# EAGLE design eeZeeAmp (EAGLE 7.1.0)
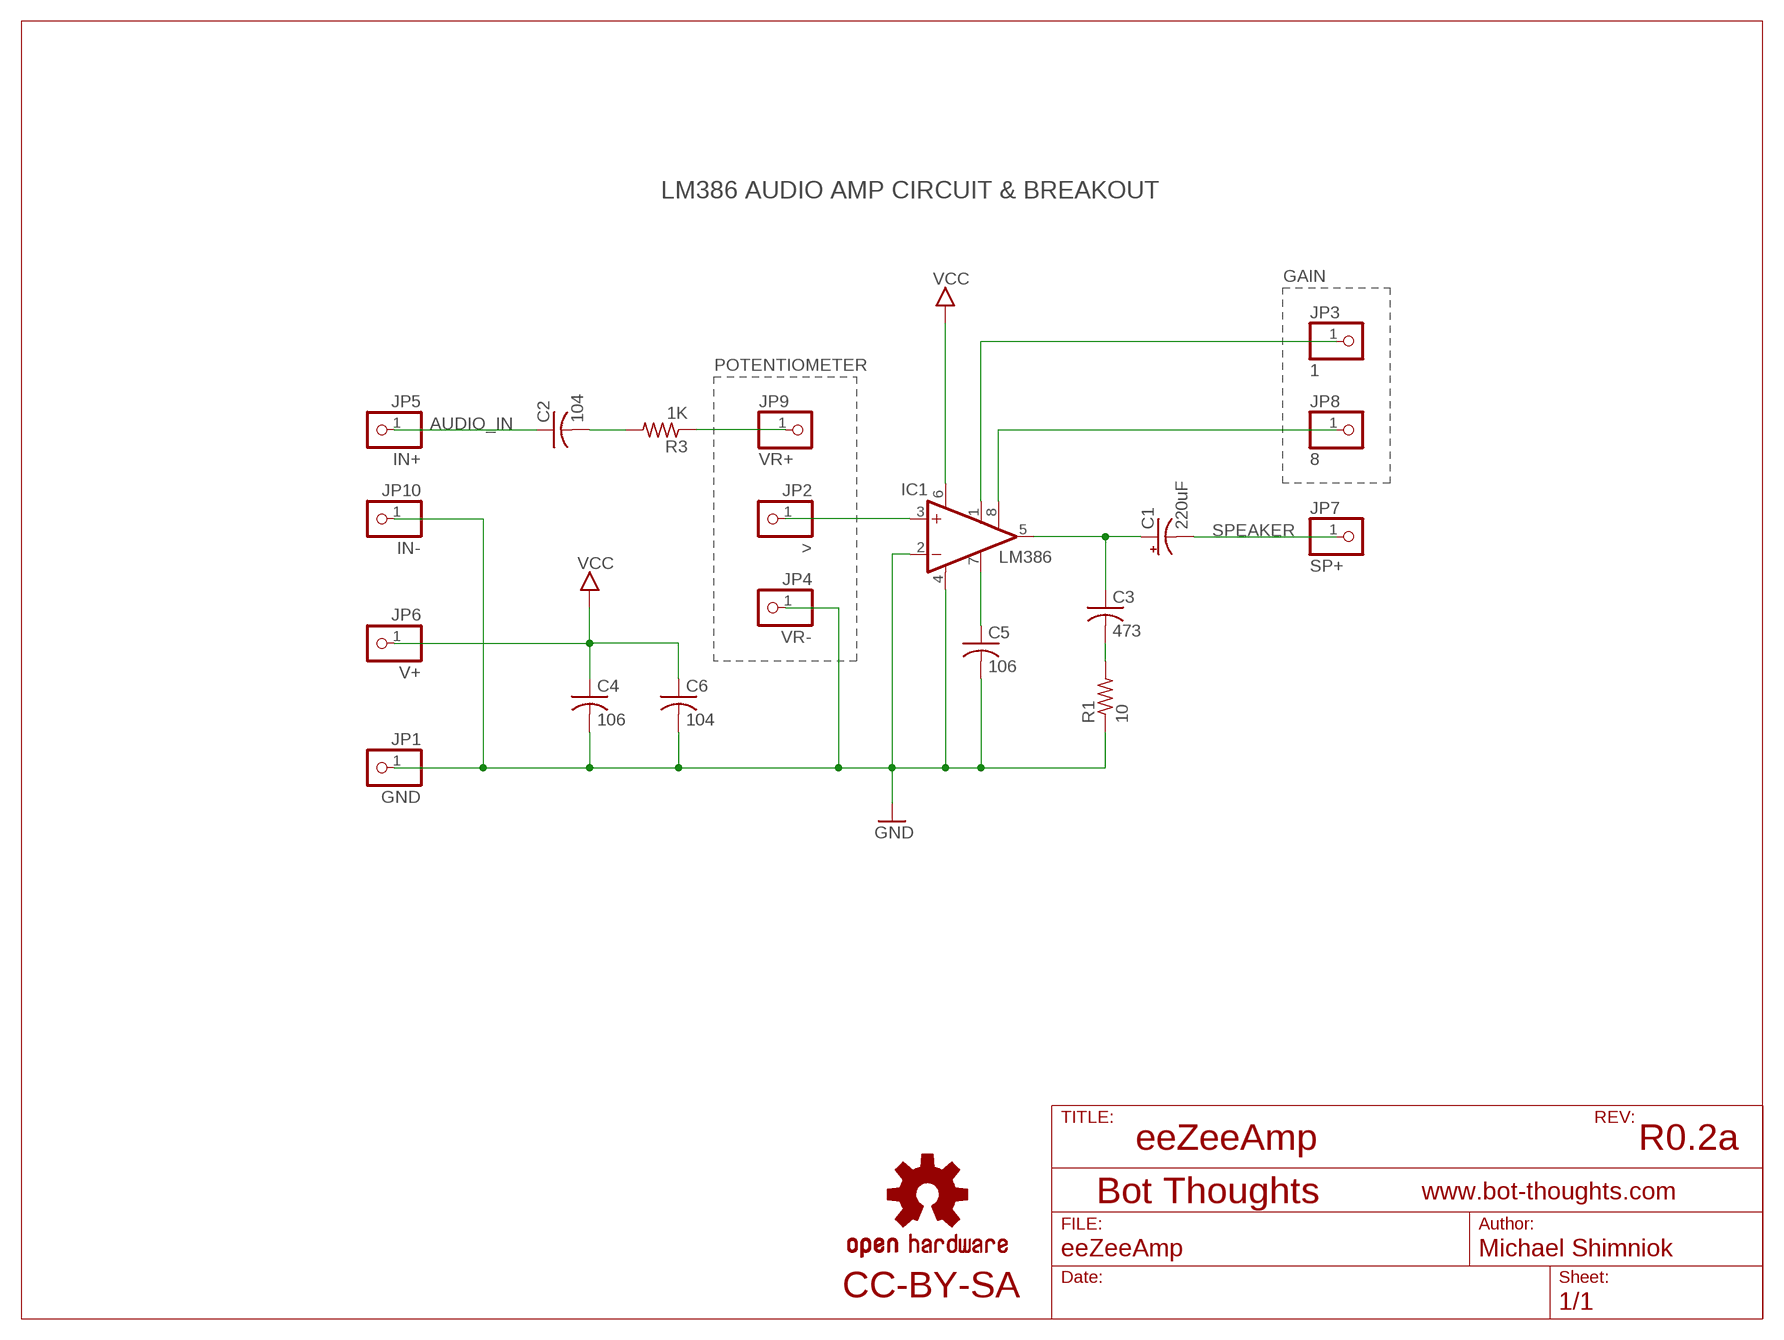
[diagram p0: schematic, sheet 1]

## Parts
C1  220uF  CPOL-USE3.5-8  [E3,5-8]
C2  104  C-USC0603  [C0603]
C3  473  C-USC0603  [C0603]
C4  106  C-USC1206  [C1206]
C5  106  C-USC1206  [C1206]
C6  104  C-USC0603  [C0603]
IC1  LM386  LM386M-1  [SO08]
JP1  GND  PINHD-1X01_2.54-S  [1X01-S]
JP2  >  PINHD-1X01_2.54-S  [1X01-S]
JP3  1  PINHD-1X01_2.54-S  [1X01-S]
JP4  VR-  PINHD-1X01_2.54-S  [1X01-S]
JP5  IN+  PINHD-1X01_2.54-S  [1X01-S]
JP6  V+  PINHD-1X01_2.54-S  [1X01-S]
JP7  SP+  PINHD-1X01_2.54-S  [1X01-S]
JP8  8  PINHD-1X01_2.54-S  [1X01-S]
JP9  VR+  PINHD-1X01_2.54-S  [1X01-S]
JP10  IN-  PINHD-1X01_2.54-S  [1X01-S]
LOGO2  OSHW-LOGOS  [OSHW-LOGO-S]
R1  10  R-US_R0603  [R0603]
R3  1K  R-US_R0603  [R0603]

## Nets
1: IC1.1(GAIN) JP3.1
3: IC1.3(+IN) JP2.1
5: C1.+ C3.1 IC1.5(OUT)
7: C5.1 IC1.7(BYPASS)
8: IC1.8(GAIN) JP8.1
AUDIO_IN: C2.1 JP5.1
GND: C4.2 C5.2 C6.2 IC1.2(-IN) IC1.4(GND) JP1.1 JP4.1 JP10.1 R1.1
N$2: C2.2 R3.2
N$4: C3.2 R1.2
N$8: JP9.1 R3.1
SPEAKER: C1.- JP7.1
VCC: C4.1 C6.1 IC1.6(VS) JP6.1

## Notes on the sheet
- LM386 AUDIO AMP CIRCUIT & BREAKOUT
- GAIN
- POTENTIOMETER
- eeZeeAmp | R0.2a
- CC-BY-SA

## Library data of the parts
C1 = rcl:CPOL-US: POLARIZED CAPACITOR, American symbol
C2-C6 = rcl:C-US: CAPACITOR, American symbol
IC1 = linear:LM386?-*: Low Voltage Audio Power Amplifier Source: http://cache.national.com/ds/LM/LM386.pdf
JP1-JP10 = pinhead-2:PINHD-1X01: PIN HEADER
LOGO2 = SparkFun-Aesthetics:OSHW-LOGO: Open Source Hardware Logo This logo indicates the piece of hardware it is found on incorporates a OSHW license and/or adheres to the definition of open source hardware found here: http://freedomdefined.org/OSHW
R1 R3 = resistor:R-US_: RESISTOR, American symbol

## Board
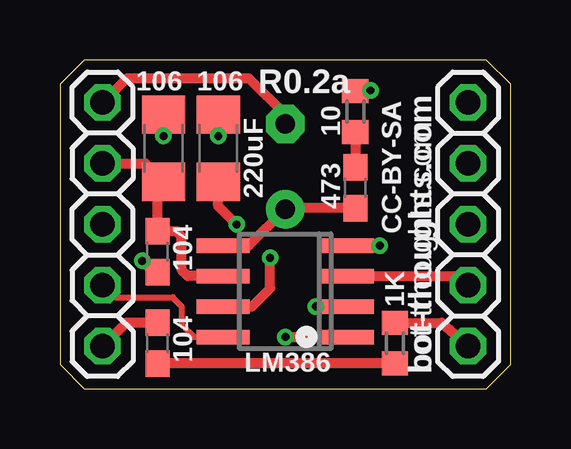
[diagram p1: board, top side]
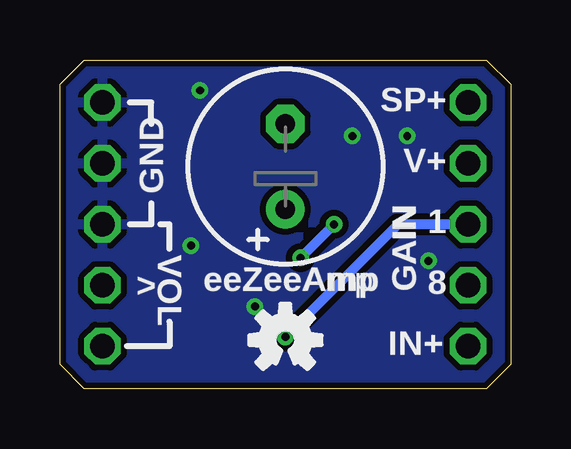
[diagram p2: board, bottom side, seen from below]

Size 18.8 x 13.72 mm. Coordinates in mm from the lower left corner, seen from the top.
Outline: 0,12.7 0,1.02 1.02,0 17.78,0 18.8,1.02 18.8,12.7 17.78,13.72 1.02,13.72 0,12.7
Copper layers (1*16): Top 0.0356mm / dielectric 1.5011mm / Bottom 0.0356mm
Design rules "LaenPCBOrder *": minimum track width 6mil, minimum drill 13mil, track to track 10mil, track to pad 10mil, pad to pad 10mil, via to via 10mil, smd to smd 8mil, copper to edge 10mil, drill to drill 10mil, minimum pad ring 7mil, minimum via ring 7mil, stop-mask expansion 3mil, vias tented up to drill 20mil, thermal gap 10mil

### Footprints (pad centres in the part's own frame; a part is rotated, then mirrored left to right if it is on the bottom)
E3,5-8 = drill 0.813 pad 1.6: + -1.778,0 | drill 0.813 pad 1.6 octagon: - 1.778,0
C0603 = smd 1.1 x 1: 1 -0.85,0; 2 0.85,0
C1206 = smd 1.6 x 1.8: 1 -1.4,0; 2 1.4,0
SO08 = smd 0.6 x 2.2: 1 -1.905,-2.6; 2 -0.635,-2.6; 3 0.635,-2.6; 4 1.905,-2.6; 5 1.905,2.6; 6 0.635,2.6; 7 -0.635,2.6; 8 -1.905,2.6
1X01-S = drill 1.016 octagon: 1 0,0
R0603 = smd 1 x 1.1: 1 -0.85,0; 2 0.85,0

### Placement (x,y rotation side)
C1  9.4,9.27 90 bottom
C2  4.06,1.91 270 top
C3  12.32,8.38 90 top
C4  4.32,10.03 90 top
C5  6.6,10.03 90 top
C6  4.06,5.71 270 top
IC1  9.4,4.06 90 top
JP1  17.02,11.94 0 top
JP2  17.02,4.32 0 top
JP3  1.78,6.86 180 top
JP4  17.02,6.86 0 top
JP5  1.78,1.78 0 top
JP6  1.78,9.4 0 top
JP7  1.78,11.94 180 top
JP8  1.78,4.32 0 top
JP9  17.02,1.78 0 top
JP10  17.02,9.4 0 top
LOGO2  9.4,2.03 0 bottom
R1  12.32,11.56 270 top
R3  13.97,1.91 270 top

### Tracks (layer width: path | path; a pad name or v marks a point on that pad's centre or on a via)
1  (via drill 0.33)
  Top 0.406: v9.4,2.16 IC1.1
  Bottom 0.406: JP3.1 4.7,6.86 v9.4,2.16
3
  Top 0.406: IC1.3 16.64,4.7 JP2.1
5
  Top 0.406: C3.1 9.4,7.53 C1.+ 7.87,5.97 IC1.5
7  (via drill 0.33)
  Top 0.406: IC1.7 8,3.43 8.76,4.19 v8.76,5.46 | v7.37,6.86 6.6,7.62 C5.1
  Bottom 0.406: v8.76,5.46 v7.37,6.86
8
  Top 0.254: JP8.1 2.29,3.81 4.7,3.81 5.08,3.43 5.08,2.67 5.59,2.16 IC1.8
AUDIO_IN
  Top 0.406: C2.1 2.75,2.75 JP5.1
GND  (via drill 0.33)
  Top 0.406: C5.2 v6.6,10.54 | IC1.2 v10.67,3.43 | IC1.4 v13.34,5.97 | C4.2 v4.32,10.54 | v12.95,12.45 12.36,12.45 R1.1 | C6.2 3.9,4.87 v3.43,5.33
  pour Bottom: 1.02,13.72 17.78,13.72 18.8,12.7 18.8,1.02 17.78,0 1.02,0 0,1.02 0,12.7
N$2
  Top 0.406: R3.2 C2.2
N$4
  Top 0.406: R1.2 C3.2
N$8
  Top 0.406: R3.1 15.91,2.75 JP9.1
SPEAKER
  Top 0.406: JP7.1 2.79,12.95 7.87,12.95 9.4,11.43 C1.-
VCC
  Top 0.406: JP6.1 3.55,9.4 C4.1 4.06,8.38 C6.1 4.87,6.57 5.08,6.35 5.08,4.95 5.33,4.7 IC1.6

### Text on the board
bPlace: VOL | GAIN
tNames: R0.2a | CC-BY-SA | bot-thoughts.com
bNames: eeZeeAmp
tsilk: 106 | 106 | R0.2a | 10 | 220uF | 104 | 473 | CC-BY-SA | 104 | 1K | LM386 | bot-thoughts.com
bsilk: SP+ | V+ | GND | 1 | VOL | 8 | GAIN | eeZeeAmp | > | IN+